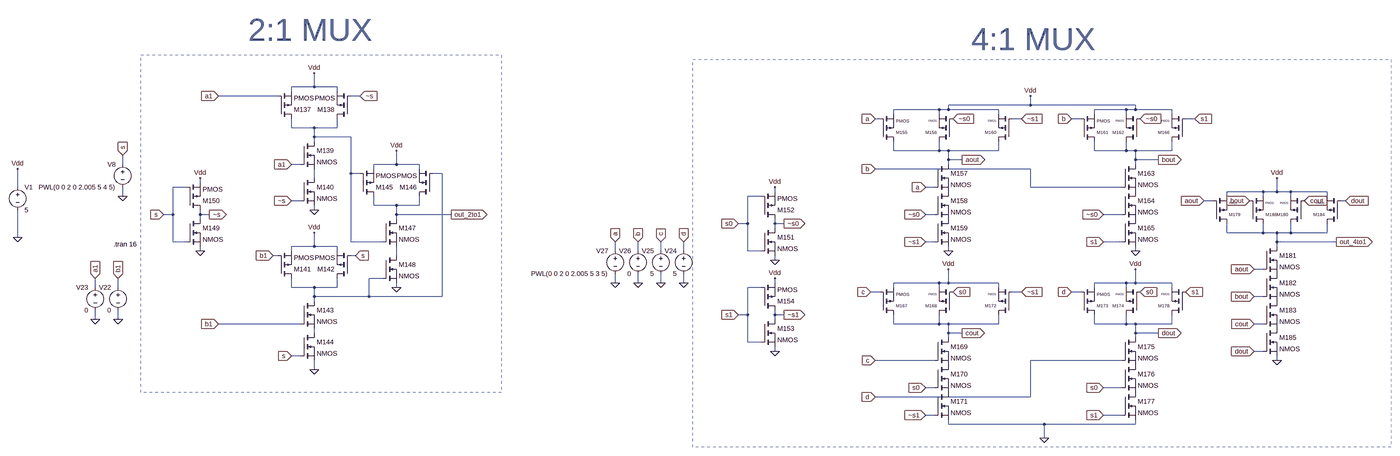
[diagram p0: schematic Multiplexer.asc, whole sheet]
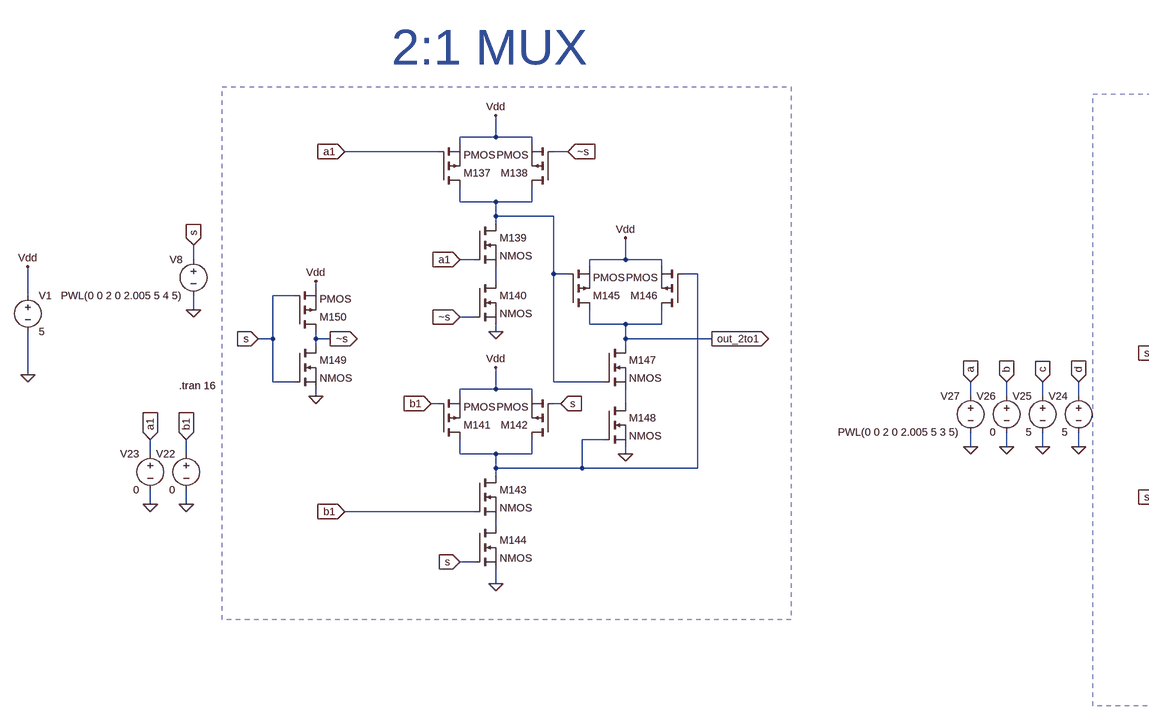
[diagram p1: schematic Multiplexer.asc, part, row 1 of 1, column 1 of 2]
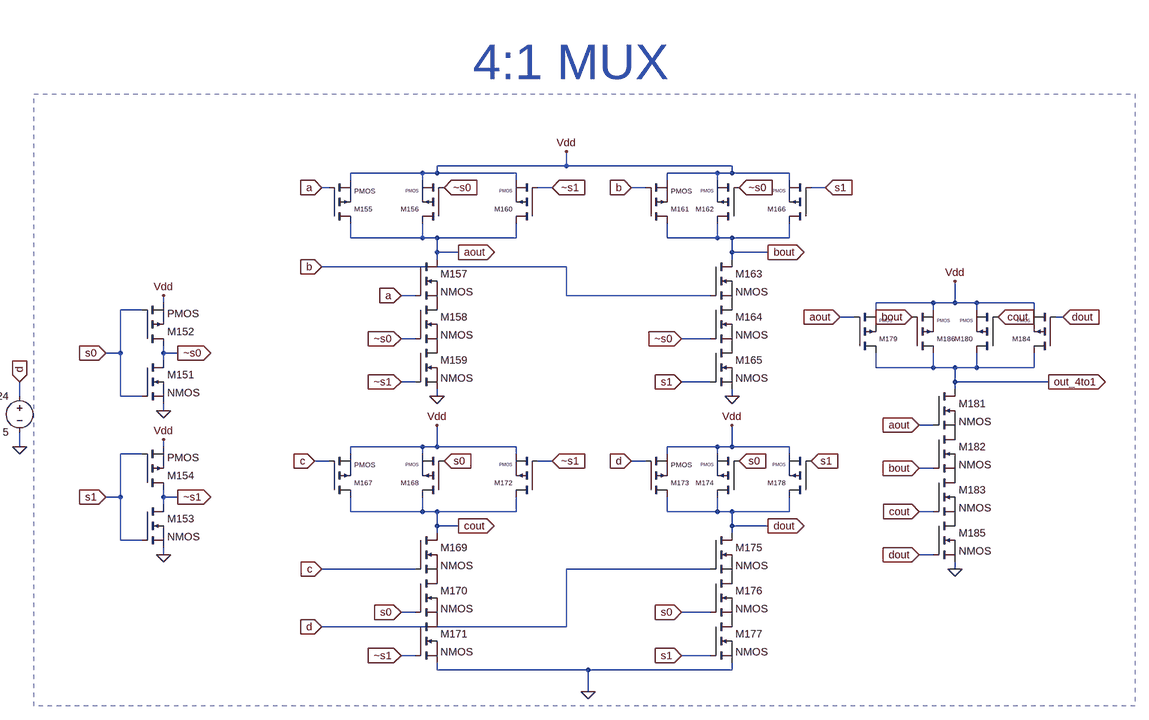
[diagram p2: schematic Multiplexer.asc, part, row 1 of 1, column 2 of 2]
Multiplexer.asc, the LTspice schematic file:
Version 4
SHEET 1 5552 4060
WIRE -6480 -720 -6480 -768
WIRE -6480 -720 -6560 -720
WIRE -6400 -720 -6480 -720
WIRE -6560 -704 -6560 -720
WIRE -6400 -704 -6400 -720
WIRE -6608 -688 -6816 -688
WIRE -6320 -688 -6352 -688
WIRE -3904 -656 -3904 -688
WIRE -3904 -656 -4192 -656
WIRE -3536 -656 -3904 -656
WIRE -4224 -640 -4384 -640
WIRE -4192 -640 -4192 -656
WIRE -4192 -640 -4224 -640
WIRE -4016 -640 -4192 -640
WIRE -3568 -640 -3680 -640
WIRE -3536 -640 -3536 -656
WIRE -3536 -640 -3568 -640
WIRE -3408 -640 -3536 -640
WIRE -4384 -624 -4384 -640
WIRE -4224 -624 -4224 -640
WIRE -4016 -624 -4016 -640
WIRE -3680 -624 -3680 -640
WIRE -3568 -624 -3568 -640
WIRE -3408 -624 -3408 -640
WIRE -4432 -608 -4448 -608
WIRE -3936 -608 -3968 -608
WIRE -3728 -608 -3760 -608
WIRE -3328 -608 -3360 -608
WIRE -6560 -576 -6560 -608
WIRE -6480 -576 -6560 -576
WIRE -6400 -576 -6400 -608
WIRE -6400 -576 -6480 -576
WIRE -6480 -544 -6480 -576
WIRE -6352 -544 -6480 -544
WIRE -6480 -528 -6480 -544
WIRE -4384 -496 -4384 -528
WIRE -4224 -496 -4224 -528
WIRE -4224 -496 -4384 -496
WIRE -4192 -496 -4224 -496
WIRE -4016 -496 -4016 -528
WIRE -4016 -496 -4192 -496
WIRE -3680 -496 -3680 -528
WIRE -3568 -496 -3568 -528
WIRE -3568 -496 -3680 -496
WIRE -3536 -496 -3568 -496
WIRE -3408 -496 -3408 -528
WIRE -3408 -496 -3536 -496
WIRE -4192 -464 -4192 -496
WIRE -4144 -464 -4192 -464
WIRE -3536 -464 -3536 -496
WIRE -3456 -464 -3536 -464
WIRE -7152 -448 -7152 -480
WIRE -6528 -448 -6560 -448
WIRE -6192 -448 -6192 -496
WIRE -6192 -448 -6272 -448
WIRE -6112 -448 -6192 -448
WIRE -4192 -448 -4192 -464
WIRE -3536 -448 -3536 -464
WIRE -6272 -432 -6272 -448
WIRE -6112 -432 -6112 -448
WIRE -3904 -432 -4448 -432
WIRE -6352 -416 -6352 -544
WIRE -6320 -416 -6352 -416
WIRE -6032 -416 -6064 -416
WIRE -6480 -400 -6480 -432
WIRE -6880 -384 -6880 -400
WIRE -7520 -368 -7520 -432
WIRE -6928 -368 -6976 -368
WIRE -4240 -368 -4272 -368
WIRE -3904 -368 -3904 -432
WIRE -3584 -368 -3904 -368
WIRE -4800 -352 -4800 -368
WIRE -3088 -352 -3216 -352
WIRE -3040 -352 -3040 -400
WIRE -3040 -352 -3088 -352
WIRE -2992 -352 -3040 -352
WIRE -2864 -352 -2992 -352
WIRE -7152 -336 -7152 -368
WIRE -4848 -336 -4896 -336
WIRE -3216 -336 -3216 -352
WIRE -3088 -336 -3088 -352
WIRE -2992 -336 -2992 -352
WIRE -2864 -336 -2864 -352
WIRE -6528 -320 -6560 -320
WIRE -3264 -320 -3296 -320
WIRE -2800 -320 -2816 -320
WIRE -6272 -304 -6272 -336
WIRE -6192 -304 -6272 -304
WIRE -6112 -304 -6112 -336
WIRE -6112 -304 -6192 -304
WIRE -6480 -288 -6480 -304
WIRE -6976 -272 -6976 -368
WIRE -6976 -272 -7008 -272
WIRE -6880 -272 -6880 -288
WIRE -6848 -272 -6880 -272
WIRE -6192 -272 -6192 -304
WIRE -6000 -272 -6192 -272
WIRE -4240 -272 -4272 -272
WIRE -3584 -272 -3648 -272
WIRE -6880 -256 -6880 -272
WIRE -6192 -256 -6192 -272
WIRE -4896 -240 -4896 -336
WIRE -4896 -240 -4928 -240
WIRE -4800 -240 -4800 -256
WIRE -4768 -240 -4800 -240
WIRE -4800 -224 -4800 -240
WIRE -3216 -208 -3216 -240
WIRE -3088 -208 -3088 -240
WIRE -3088 -208 -3216 -208
WIRE -3040 -208 -3088 -208
WIRE -2992 -208 -2992 -240
WIRE -2992 -208 -3040 -208
WIRE -2864 -208 -2864 -240
WIRE -2864 -208 -2992 -208
WIRE -7520 -192 -7520 -288
WIRE -6976 -176 -6976 -272
WIRE -6928 -176 -6976 -176
WIRE -6352 -176 -6352 -416
WIRE -6240 -176 -6352 -176
WIRE -4240 -176 -4272 -176
WIRE -3584 -176 -3648 -176
WIRE -3040 -176 -3040 -208
WIRE -2832 -176 -3040 -176
WIRE -6480 -160 -6480 -208
WIRE -6480 -160 -6560 -160
WIRE -6400 -160 -6480 -160
WIRE -3040 -160 -3040 -176
WIRE -6880 -144 -6880 -160
WIRE -6560 -144 -6560 -160
WIRE -6400 -144 -6400 -160
WIRE -5360 -144 -5360 -176
WIRE -5280 -144 -5280 -176
WIRE -5200 -144 -5200 -176
WIRE -5120 -144 -5120 -176
WIRE -4896 -144 -4896 -240
WIRE -4848 -144 -4896 -144
WIRE -4192 -144 -4192 -160
WIRE -3536 -144 -3536 -160
WIRE -6608 -128 -6624 -128
WIRE -6336 -128 -6352 -128
WIRE -6192 -128 -6192 -160
WIRE -4800 -112 -4800 -128
WIRE -3088 -80 -3120 -80
WIRE -6240 -48 -6288 -48
WIRE -5360 -32 -5360 -64
WIRE -5280 -32 -5280 -64
WIRE -5200 -32 -5200 -64
WIRE -5120 -32 -5120 -64
WIRE -4800 -32 -4800 -48
WIRE -4224 -32 -4384 -32
WIRE -4192 -32 -4192 -80
WIRE -4192 -32 -4224 -32
WIRE -4016 -32 -4192 -32
WIRE -3568 -32 -3680 -32
WIRE -3536 -32 -3536 -80
WIRE -3536 -32 -3568 -32
WIRE -3408 -32 -3536 -32
WIRE -7248 -16 -7248 -48
WIRE -7168 -16 -7168 -48
WIRE -6560 -16 -6560 -48
WIRE -6480 -16 -6560 -16
WIRE -6400 -16 -6400 -48
WIRE -6400 -16 -6480 -16
WIRE -6192 -16 -6192 -32
WIRE -4848 -16 -4896 -16
WIRE -4384 -16 -4384 -32
WIRE -4224 -16 -4224 -32
WIRE -4016 -16 -4016 -32
WIRE -3680 -16 -3680 -32
WIRE -3568 -16 -3568 -32
WIRE -3408 -16 -3408 -32
WIRE -4432 0 -4464 0
WIRE -3936 0 -3968 0
WIRE -3728 0 -3760 0
WIRE -6480 16 -6480 -16
WIRE -6288 16 -6288 -48
WIRE -6288 16 -6480 16
WIRE -6032 16 -6032 -416
WIRE -6032 16 -6288 16
WIRE -3088 16 -3120 16
WIRE -6480 32 -6480 16
WIRE -4896 80 -4896 -16
WIRE -4896 80 -4928 80
WIRE -4800 80 -4800 64
WIRE -4768 80 -4800 80
WIRE -7248 96 -7248 64
WIRE -7168 96 -7168 64
WIRE -4800 96 -4800 80
WIRE -6528 112 -6816 112
WIRE -4384 112 -4384 80
WIRE -4224 112 -4224 80
WIRE -4224 112 -4384 112
WIRE -4192 112 -4224 112
WIRE -4016 112 -4016 80
WIRE -4016 112 -4192 112
WIRE -3680 112 -3680 80
WIRE -3568 112 -3568 80
WIRE -3568 112 -3680 112
WIRE -3536 112 -3568 112
WIRE -3408 112 -3408 80
WIRE -3408 112 -3536 112
WIRE -3088 112 -3120 112
WIRE -6480 144 -6480 128
WIRE -4192 144 -4192 112
WIRE -4144 144 -4192 144
WIRE -3536 144 -3536 112
WIRE -3456 144 -3536 144
WIRE -4192 160 -4192 144
WIRE -3536 160 -3536 144
WIRE -4896 176 -4896 80
WIRE -4848 176 -4896 176
WIRE -4800 208 -4800 192
WIRE -3088 208 -3120 208
WIRE -6528 224 -6560 224
WIRE -4240 240 -4448 240
WIRE -3584 240 -3904 240
WIRE -3040 240 -3040 224
WIRE -6480 272 -6480 240
WIRE -4240 336 -4272 336
WIRE -3584 336 -3648 336
WIRE -3904 368 -3904 240
WIRE -3904 368 -4448 368
WIRE -4240 432 -4272 432
WIRE -3584 432 -3648 432
WIRE -4192 464 -4192 448
WIRE -3856 464 -4192 464
WIRE -3536 464 -3536 448
WIRE -3536 464 -3856 464
WIRE -3856 512 -3856 464
FLAG -7520 -192 0
FLAG -7520 -432 Vdd
FLAG -7152 -336 0
FLAG -7152 -480 s
IOPIN -7152 -480 In
FLAG -7168 96 0
FLAG -7168 -48 b1
IOPIN -7168 -48 In
FLAG -7248 96 0
FLAG -7248 -48 a1
IOPIN -7248 -48 In
FLAG -6480 -768 Vdd
FLAG -6480 -288 0
FLAG -6560 -320 ~s
IOPIN -6560 -320 In
FLAG -6560 -448 a1
IOPIN -6560 -448 In
FLAG -6816 -688 a1
IOPIN -6816 -688 In
FLAG -6320 -688 ~s
IOPIN -6320 -688 In
FLAG -6480 -208 Vdd
FLAG -6480 272 0
FLAG -6560 224 s
IOPIN -6560 224 In
FLAG -6816 112 b1
IOPIN -6816 112 In
FLAG -6624 -128 b1
IOPIN -6624 -128 In
FLAG -6336 -128 s
IOPIN -6336 -128 In
FLAG -6192 -496 Vdd
FLAG -6192 -16 0
FLAG -6000 -272 out_2to1
IOPIN -6000 -272 Out
FLAG -6880 -144 0
FLAG -6880 -400 Vdd
FLAG -6848 -272 ~s
IOPIN -6848 -272 Out
FLAG -7008 -272 s
IOPIN -7008 -272 In
FLAG -5120 -32 0
FLAG -5120 -176 d
IOPIN -5120 -176 In
FLAG -5200 -32 0
FLAG -5200 -176 c
IOPIN -5200 -176 In
FLAG -4800 -112 0
FLAG -4800 -368 Vdd
FLAG -4768 -240 ~s0
IOPIN -4768 -240 Out
FLAG -4928 -240 s0
IOPIN -4928 -240 In
FLAG -4800 208 0
FLAG -4800 -48 Vdd
FLAG -4768 80 ~s1
IOPIN -4768 80 Out
FLAG -4928 80 s1
IOPIN -4928 80 In
FLAG -3904 -688 Vdd
FLAG -4448 -608 a
IOPIN -4448 -608 In
FLAG -4176 -608 ~s0
IOPIN -4176 -608 In
FLAG -4144 -464 aout
IOPIN -4144 -464 Out
FLAG -4272 -272 ~s0
IOPIN -4272 -272 In
FLAG -4272 -368 a
IOPIN -4272 -368 In
FLAG -4192 -144 0
FLAG -4272 -176 ~s1
IOPIN -4272 -176 In
FLAG -3936 -608 ~s1
IOPIN -3936 -608 In
FLAG -3760 -608 b
IOPIN -3760 -608 In
FLAG -3520 -608 ~s0
IOPIN -3520 -608 In
FLAG -3456 -464 bout
IOPIN -3456 -464 Out
FLAG -3648 -272 ~s0
IOPIN -3648 -272 In
FLAG -4448 -432 b
IOPIN -4448 -432 In
FLAG -3536 -144 0
FLAG -3648 -176 s1
IOPIN -3648 -176 In
FLAG -3328 -608 s1
IOPIN -3328 -608 In
FLAG -4192 -80 Vdd
FLAG -4464 0 c
IOPIN -4464 0 In
FLAG -4176 0 s0
IOPIN -4176 0 In
FLAG -4144 144 cout
IOPIN -4144 144 Out
FLAG -4272 336 s0
IOPIN -4272 336 In
FLAG -4448 240 c
IOPIN -4448 240 In
FLAG -4272 432 ~s1
IOPIN -4272 432 In
FLAG -3936 0 ~s1
IOPIN -3936 0 In
FLAG -3536 -80 Vdd
FLAG -3760 0 d
IOPIN -3760 0 In
FLAG -3520 0 s0
IOPIN -3520 0 In
FLAG -3456 144 dout
IOPIN -3456 144 Out
FLAG -3648 336 s0
IOPIN -3648 336 In
FLAG -4448 368 d
IOPIN -4448 368 In
FLAG -3648 432 s1
IOPIN -3648 432 In
FLAG -5280 -32 0
FLAG -5280 -176 b
IOPIN -5280 -176 In
FLAG -5360 -32 0
FLAG -5360 -176 a
IOPIN -5360 -176 In
FLAG -3040 -400 Vdd
FLAG -3296 -320 aout
IOPIN -3296 -320 In
FLAG -2944 -320 cout
IOPIN -2944 -320 In
FLAG -2832 -176 out_4to1
IOPIN -2832 -176 Out
FLAG -3120 16 bout
IOPIN -3120 16 In
FLAG -3120 -80 aout
IOPIN -3120 -80 In
FLAG -3120 112 cout
IOPIN -3120 112 In
FLAG -2800 -320 dout
IOPIN -2800 -320 In
FLAG -3040 240 0
FLAG -3120 208 dout
IOPIN -3120 208 In
FLAG -3136 -320 bout
IOPIN -3136 -320 In
FLAG -3856 512 0
FLAG -3360 0 s1
IOPIN -3360 0 In
SYMBOL voltage -7520 -384 R0
SYMATTR InstName V1
SYMATTR Value 5
SYMBOL voltage -7152 -464 M0
SYMATTR InstName V8
SYMATTR Value PWL(0 0 2 0 2.005 5 4 5)
SYMBOL voltage -7168 -32 M0
SYMATTR InstName V22
SYMATTR Value 0
SYMBOL voltage -7248 -32 M0
SYMATTR InstName V23
SYMATTR Value 0
SYMBOL pmos -6608 -608 M180
SYMATTR InstName M137
SYMBOL pmos -6352 -608 R180
SYMATTR InstName M138
SYMBOL nmos -6528 -528 R0
SYMATTR InstName M139
SYMBOL nmos -6528 -400 R0
SYMATTR InstName M140
SYMBOL pmos -6608 -48 M180
SYMATTR InstName M141
SYMBOL pmos -6352 -48 R180
SYMATTR InstName M142
SYMBOL nmos -6528 32 R0
SYMATTR InstName M143
SYMBOL nmos -6528 144 R0
SYMATTR InstName M144
SYMBOL pmos -6320 -336 M180
SYMATTR InstName M145
SYMBOL pmos -6064 -336 R180
SYMATTR InstName M146
SYMBOL nmos -6240 -256 R0
SYMATTR InstName M147
SYMBOL nmos -6240 -128 R0
SYMATTR InstName M148
SYMBOL nmos -6928 -256 R0
SYMATTR InstName M149
SYMBOL pmos -6928 -288 M180
SYMATTR InstName M150
SYMBOL voltage -5120 -160 M0
SYMATTR InstName V24
SYMATTR Value 5
SYMBOL voltage -5200 -160 M0
SYMATTR InstName V25
SYMATTR Value 5
SYMBOL nmos -4848 -224 R0
SYMATTR InstName M151
SYMBOL pmos -4848 -256 M180
SYMATTR InstName M152
SYMBOL nmos -4848 96 R0
SYMATTR InstName M153
SYMBOL pmos -4848 64 M180
SYMATTR InstName M154
SYMBOL pmos -4432 -528 M180
WINDOW 0 56 32 Left 1
WINDOW 3 56 72 Left 1
SYMATTR InstName M155
SYMBOL pmos -4176 -528 R180
WINDOW 0 56 32 Left 1
WINDOW 3 56 72 Left 0
SYMATTR InstName M156
SYMBOL nmos -4240 -448 R0
SYMATTR InstName M157
SYMBOL nmos -4240 -352 R0
SYMATTR InstName M158
SYMBOL nmos -4240 -256 R0
SYMATTR InstName M159
SYMBOL pmos -3968 -528 R180
WINDOW 0 56 32 Left 1
WINDOW 3 56 72 Left 0
SYMATTR InstName M160
SYMBOL pmos -3728 -528 M180
WINDOW 0 56 32 Left 1
WINDOW 3 56 72 Left 1
SYMATTR InstName M161
SYMBOL pmos -3520 -528 R180
WINDOW 0 56 32 Left 1
WINDOW 3 56 72 Left 0
SYMATTR InstName M162
SYMBOL nmos -3584 -448 R0
SYMATTR InstName M163
SYMBOL nmos -3584 -352 R0
SYMATTR InstName M164
SYMBOL nmos -3584 -256 R0
SYMATTR InstName M165
SYMBOL pmos -3360 -528 R180
WINDOW 0 56 32 Left 1
WINDOW 3 56 72 Left 0
SYMATTR InstName M166
SYMBOL pmos -4432 80 M180
WINDOW 0 56 32 Left 1
WINDOW 3 56 72 Left 1
SYMATTR InstName M167
SYMBOL pmos -4176 80 R180
WINDOW 0 56 32 Left 1
WINDOW 3 56 72 Left 0
SYMATTR InstName M168
SYMBOL nmos -4240 160 R0
SYMATTR InstName M169
SYMBOL nmos -4240 256 R0
SYMATTR InstName M170
SYMBOL nmos -4240 352 R0
SYMATTR InstName M171
SYMBOL pmos -3968 80 R180
WINDOW 0 56 32 Left 1
WINDOW 3 56 72 Left 0
SYMATTR InstName M172
SYMBOL pmos -3728 80 M180
WINDOW 0 56 32 Left 1
WINDOW 3 56 72 Left 1
SYMATTR InstName M173
SYMBOL pmos -3520 80 R180
WINDOW 0 56 32 Left 1
WINDOW 3 56 72 Left 0
SYMATTR InstName M174
SYMBOL nmos -3584 160 R0
SYMATTR InstName M175
SYMBOL nmos -3584 256 R0
SYMATTR InstName M176
SYMBOL nmos -3584 352 R0
SYMATTR InstName M177
SYMBOL pmos -3360 80 R180
WINDOW 0 56 32 Left 1
WINDOW 3 56 72 Left 0
SYMATTR InstName M178
SYMBOL voltage -5280 -160 M0
SYMATTR InstName V26
SYMATTR Value 0
SYMBOL voltage -5360 -160 M0
WINDOW 123 0 0 Left 0
WINDOW 39 0 0 Left 0
SYMATTR InstName V27
SYMATTR Value PWL(0 0 2 0 2.005 5 3 5)
SYMBOL pmos -3264 -240 M180
WINDOW 0 56 32 Left 1
WINDOW 3 56 72 Left 0
SYMATTR InstName M179
SYMBOL pmos -2944 -240 R180
WINDOW 0 56 32 Left 1
WINDOW 3 56 72 Left 0
SYMATTR InstName M180
SYMBOL nmos -3088 -160 R0
SYMATTR InstName M181
SYMBOL nmos -3088 -64 R0
SYMATTR InstName M182
SYMBOL nmos -3088 32 R0
SYMATTR InstName M183
SYMBOL pmos -2816 -240 R180
WINDOW 0 56 32 Left 1
WINDOW 3 56 72 Left 0
SYMATTR InstName M184
SYMBOL nmos -3088 128 R0
SYMATTR InstName M185
SYMBOL pmos -3136 -240 M180
WINDOW 0 56 32 Left 1
WINDOW 3 56 72 Left 0
SYMATTR InstName M186
TEXT -7184 -168 Left 2 !.tran 16
TEXT -6712 -920 Left 7 ;2:1 MUX
TEXT -4112 -888 Left 7 ;4:1 MUX
RECTANGLE Normal -5824 352 -7088 -832 2
RECTANGLE Normal -2640 544 -5088 -816 2

The netlist it stands for:
* Multiplexer.asc
V1 Vdd 0 5
V8 s 0 PWL(0 0 2 0 2.005 5 4 5)
V22 b1 0 0
V23 a1 0 0
M137 N001 a1 Vdd Vdd PMOS
M138 N001 ~s Vdd Vdd PMOS
M139 N001 a1 N003 N003 NMOS
M140 N003 ~s 0 0 NMOS
M141 N002 b1 Vdd Vdd PMOS
M142 N002 s Vdd Vdd PMOS
M143 N002 b1 N005 N005 NMOS
M144 N005 s 0 0 NMOS
M145 out_2to1 N001 Vdd Vdd PMOS
M146 out_2to1 N002 Vdd Vdd PMOS
M147 out_2to1 N001 N004 N004 NMOS
M148 N004 N002 0 0 NMOS
M149 ~s s 0 0 NMOS
M150 ~s s Vdd Vdd PMOS
V24 d 0 5
V25 c 0 5
M151 ~s0 s0 0 0 NMOS
M152 ~s0 s0 Vdd Vdd PMOS
M153 ~s1 s1 0 0 NMOS
M154 ~s1 s1 Vdd Vdd PMOS
M155 aout a Vdd Vdd PMOS
M156 aout ~s0 Vdd Vdd PMOS
M157 aout a P001 P001 NMOS
M158 P001 ~s0 P002 P002 NMOS
M159 P002 ~s1 0 0 NMOS
M160 aout ~s1 Vdd Vdd PMOS
M161 bout b Vdd Vdd PMOS
M162 bout ~s0 Vdd Vdd PMOS
M163 bout b P003 P003 NMOS
M164 P003 ~s0 P004 P004 NMOS
M165 P004 s1 0 0 NMOS
M166 bout s1 Vdd Vdd PMOS
M167 cout c Vdd Vdd PMOS
M168 cout s0 Vdd Vdd PMOS
M169 cout c P005 P005 NMOS
M170 P005 s0 P006 P006 NMOS
M171 P006 ~s1 0 0 NMOS
M172 cout ~s1 Vdd Vdd PMOS
M173 dout d Vdd Vdd PMOS
M174 dout s0 Vdd Vdd PMOS
M175 dout d P007 P007 NMOS
M176 P007 s0 P008 P008 NMOS
M177 P008 s1 0 0 NMOS
M178 dout s1 Vdd Vdd PMOS
V26 b 0 0
V27 a 0 PWL(0 0 2 0 2.005 5 3 5)
M179 out_4to1 aout Vdd Vdd PMOS
M180 out_4to1 cout Vdd Vdd PMOS
M181 out_4to1 aout P009 P009 NMOS
M182 P009 bout P010 P010 NMOS
M183 P010 cout P011 P011 NMOS
M184 out_4to1 dout Vdd Vdd PMOS
M185 P011 dout 0 0 NMOS
M186 out_4to1 bout Vdd Vdd PMOS
.model NMOS NMOS
.model PMOS PMOS
.lib standard.mos
.tran 16
* 2:1 MUX
* 4:1 MUX
.backanno
.end